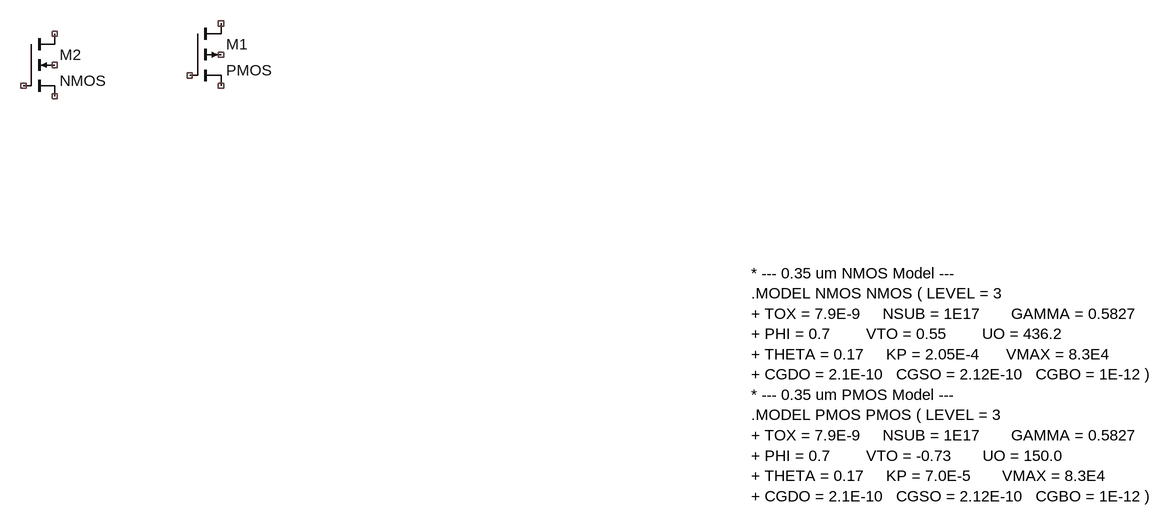
[diagram p0: schematic čip.asc]
čip.asc, the LTspice schematic file:
Version 4.1
SHEET 1 1336 724
SYMBOL pmos4 -176 16 R0
SYMATTR InstName M1
SYMBOL nmos4 -432 32 R0
SYMATTR InstName M2
TEXT 688 400 Left 2 !* --- 0.35 um NMOS Model ---\n.MODEL NMOS NMOS ( LEVEL = 3\n+ TOX = 7.9E-9     NSUB = 1E17       GAMMA = 0.5827\n+ PHI = 0.7        VTO = 0.55        UO = 436.2\n+ THETA = 0.17     KP = 2.05E-4      VMAX = 8.3E4\n+ CGDO = 2.1E-10   CGSO = 2.12E-10   CGBO = 1E-12 )\n* --- 0.35 um PMOS Model ---\n.MODEL PMOS PMOS ( LEVEL = 3\n+ TOX = 7.9E-9     NSUB = 1E17       GAMMA = 0.5827\n+ PHI = 0.7        VTO = -0.73       UO = 150.0\n+ THETA = 0.17     KP = 7.0E-5       VMAX = 8.3E4\n+ CGDO = 2.1E-10   CGSO = 2.12E-10   CGBO = 1E-12 )

The netlist it stands for:
* čip.asc
M1 NC_01 NC_02 NC_03 NC_04 PMOS
M2 NC_05 NC_06 NC_07 NC_08 NMOS
.model NMOS NMOS
.model PMOS PMOS
.lib standard.mos
* --- 0.35 um NMOS Model ---
.MODEL NMOS NMOS ( LEVEL = 3
+ TOX = 7.9E-9     NSUB = 1E17       GAMMA = 0.5827
+ PHI = 0.7        VTO = 0.55        UO = 436.2
+ THETA = 0.17     KP = 2.05E-4      VMAX = 8.3E4
+ CGDO = 2.1E-10   CGSO = 2.12E-10   CGBO = 1E-12 )
* --- 0.35 um PMOS Model ---
.MODEL PMOS PMOS ( LEVEL = 3
+ TOX = 7.9E-9     NSUB = 1E17       GAMMA = 0.5827
+ PHI = 0.7        VTO = -0.73       UO = 150.0
+ THETA = 0.17     KP = 7.0E-5       VMAX = 8.3E4
+ CGDO = 2.1E-10   CGSO = 2.12E-10   CGBO = 1E-12 )
.backanno
.end